# EAGLE design ernest (EAGLE 6.6.0)
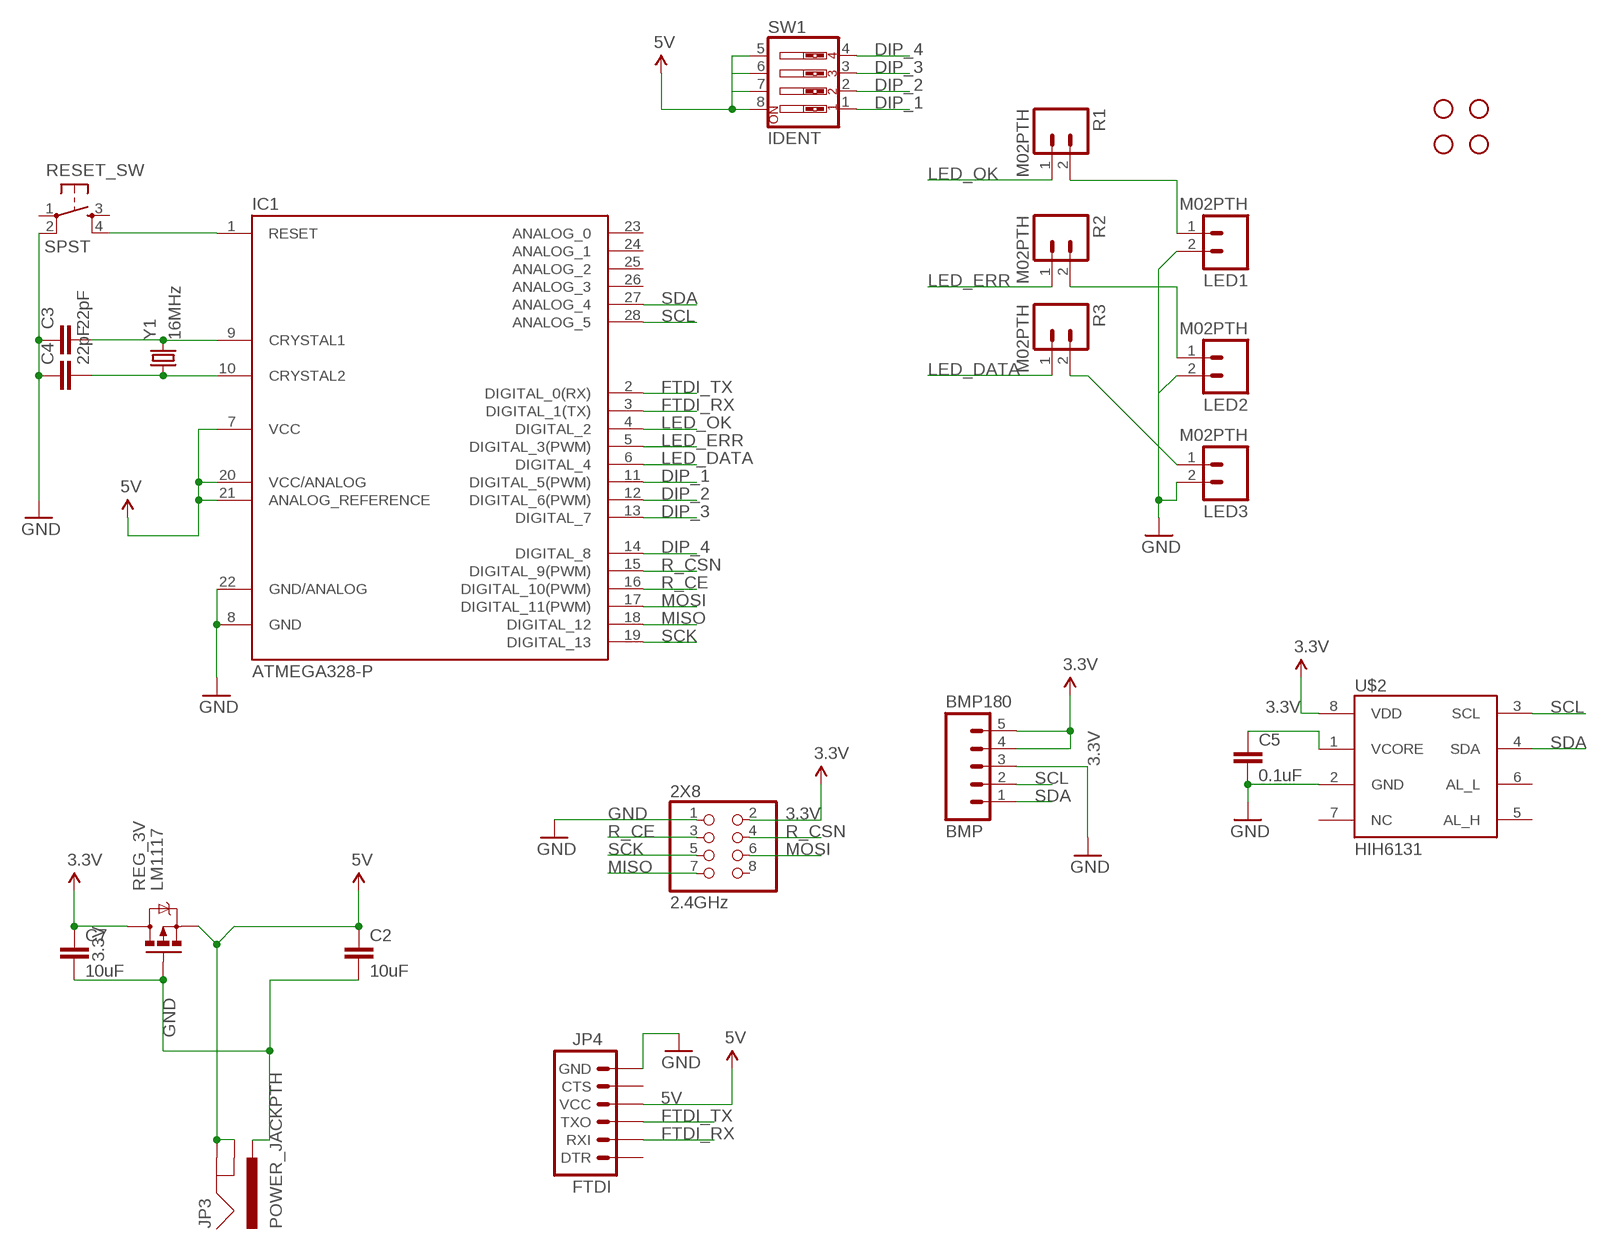
[diagram p0: schematic, sheet 1]

## Parts
2X8  2.4GHz  PINHD-2X4  [2X04]
BMP180  BMP  M05PTH  [1X05]
C2  10uF  CAPPTH  [CAP-PTH-SMALL]
C3  22pF  CAPPTH  [CAP-PTH-SMALL]
C4  22pF  CAPPTH  [CAP-PTH-SMALL]
C5  0.1uF  CAPPTH  [CAP-PTH-SMALL]
C7  10uF  CAPPTH  [CAP-PTH-SMALL]
IC1  ATMEGA328-P  ATMEGA168-PU  [DIL28-3]
JP3  POWER_JACKPTH  [POWER_JACK_PTH]
JP4  FTDI  ARDUINO_SERIAL_PROGRAMPTH  [1X06]
LED1  M02PTH  [1X02]
LED2  M02PTH  [1X02]
LED3  M02PTH  [1X02]
R1  M02PTH  [1X02]
R2  M02PTH  [1X02]
R3  M02PTH  [1X02]
REG_3V  LM1117  MOSFET-PCHANNELFQP27P06  [TO220V]
RESET_SW  SPST  TACTILE-SWITCH-PTH  [TAC-SWITCH-PTH]
STANDOFF1  STAND-OFF  [STAND-OFF]
STANDOFF2  STAND-OFF  [STAND-OFF]
STANDOFF3  STAND-OFF  [STAND-OFF]
STANDOFF4  STAND-OFF  [STAND-OFF]
SW1  IDENT  SW_DIP-4  [EDG-04]
U$2  HIH6131  [SOIC8]
Y1  16MHz  CRYSTALHC49US  [HC49US]

## Nets
3.3V: 2X8.2 BMP180.4 BMP180.5 C7.1 REG_3V.2(D) U$2.8(VDD)
5V: C2.1 IC1.7(VCC) IC1.20(VCC/ANALOG) IC1.21(ANALOG_REFERENCE) JP3.GND JP3.GNDBREAK JP4.4(VCC) REG_3V.3(S) SW1.5 SW1.6 SW1.7 SW1.8
DIP_1: IC1.11(DIGITAL_5(PWM)) SW1.1
DIP_2: IC1.12(DIGITAL_6(PWM)) SW1.2
DIP_3: IC1.13(DIGITAL_7) SW1.3
DIP_4: IC1.14(DIGITAL_8) SW1.4
FTDI_RX: IC1.3(DIGITAL_1(TX)) JP4.2(RXI)
FTDI_TX: IC1.2(DIGITAL_0(RX)) JP4.3(TXO)
GND: 2X8.1 BMP180.3 C2.2 C3.1 C4.1 C5.2 C7.2 IC1.8(GND) IC1.22(GND/ANALOG) JP3.PWR JP4.6(GND) LED1.2 LED2.2 LED3.2 REG_3V.1(G) RESET_SW.2 U$2.2(GND)
LED_DATA: IC1.6(DIGITAL_4) R3.1
LED_ERR: IC1.5(DIGITAL_3(PWM)) R2.1
LED_OK: IC1.4(DIGITAL_2) R1.1
MISO: 2X8.7 IC1.18(DIGITAL_12)
MOSI: 2X8.6 IC1.17(DIGITAL_11(PWM))
N$4: LED1.1 R1.2
N$5: LED2.1 R2.2
N$6: LED3.1 R3.2
N$12: IC1.1(RESET) RESET_SW.4
N$17: C5.1 U$2.1(VCORE)
N$20: C3.2 IC1.9(CRYSTAL1) Y1.2
N$21: C4.2 IC1.10(CRYSTAL2) Y1.1
R_CE: 2X8.3 IC1.16(DIGITAL_10(PWM))
R_CSN: 2X8.4 IC1.15(DIGITAL_9(PWM))
SCK: 2X8.5 IC1.19(DIGITAL_13)
SCL: BMP180.2 IC1.28(ANALOG_5) U$2.3(SCL)
SDA: BMP180.1 IC1.27(ANALOG_4) U$2.4(SDA)
Unconnected: 2X8.8 IC1.23(ANALOG_0) IC1.24(ANALOG_1) IC1.25(ANALOG_2) IC1.26(ANALOG_3) JP4.1(DTR) JP4.5(CTS) RESET_SW.1 RESET_SW.3 U$2.5(AL_H) U$2.6(AL_L) U$2.7(NC)

## Library data of the parts
2X8 = adafruit:PINHD-2X4: PIN HEADER
BMP180 = SparkFun-Connectors:M05: Header 5 Standard 5-pin 0.1" header. Use with straight break away headers (SKU : PRT-00116), right angle break away headers (PRT-00553), swiss pins (PRT-00743), machine pins (PRT-00117), and female headers (PRT-00115). Molex polarized connector foot print use with SKU : PRT-08230 with associated crimp pins and housings.
C2-C5 C7 = SparkFun-Capacitors:CAP: Capacitor Standard 0603 ceramic capacitor, and 0.1" leaded capacitor.
IC1 = Arduino-AVR:ATMEGA168-PU
JP3 = SparkFun-Connectors:POWER_JACK: Power Jack This is the standard 5.5mm barrel jack for power. The PTH is the most common, proven, reliable, footprint. The Slot footprint only works if the mill layer is transmitted to the PCB fab house so be warned. Mating wall wart : TOL-00298 (and others); PROD_ID: CONN-08197
JP4 = SparkFun-Connectors:ARDUINO_SERIAL_PROGRAM: FTDI connector footprints
LED1-LED3 R1-R3 = SparkFun-Connectors:M02: Standard 2-pin 0.1" header. Use with - straight break away headers ( PRT-00116) - right angle break away headers (PRT-00553) - swiss pins (PRT-00743) - machine pins (PRT-00117) - female headers (PRT-00115) Molex polarized connector foot print use with: PRT-08233 with associated crimp pins and housings. 2.54_SCREWTERM for use with PRT-10571. 3.5mm Screw Terminal footprints for PRT-08084 5mm Screw Terminal footprints for use with PRT-08432
REG_3V = User-Submitted:MOSFET-PCHANNEL: Generic PMOSFET IRLML2244 - TRANS-11153 (SOT-23 -20V -4.3A) (1.Gate 2.Source 3.Drain) FQP27P06 - COM-10349 <http://www.sparkfun.com/products/10349> (TO-220 -60V -27A) (1.Gate 2.Source 3.Drain)
RESET_SW = GeekAmmo:TACTILE-SWITCH: Tactile Switch 4 Pins, SPST NO
STANDOFF1-STANDOFF4 = SparkFun-Electromechanical:STAND-OFF: #4 Stand Off This is the mechanical footprint for a #4 phillips button head screw. Use the keepout ring to avoid running the screw head into surrounding components. SKU : PRT-00447
SW1 = special:SW_DIP-4: DIP SWITCH
U$2 = SparkFun-AnalogIC:HIH6131
Y1 = SparkFun-FreqCtrl:CRYSTAL: Various standard crystals. Proven footprints.

## Board
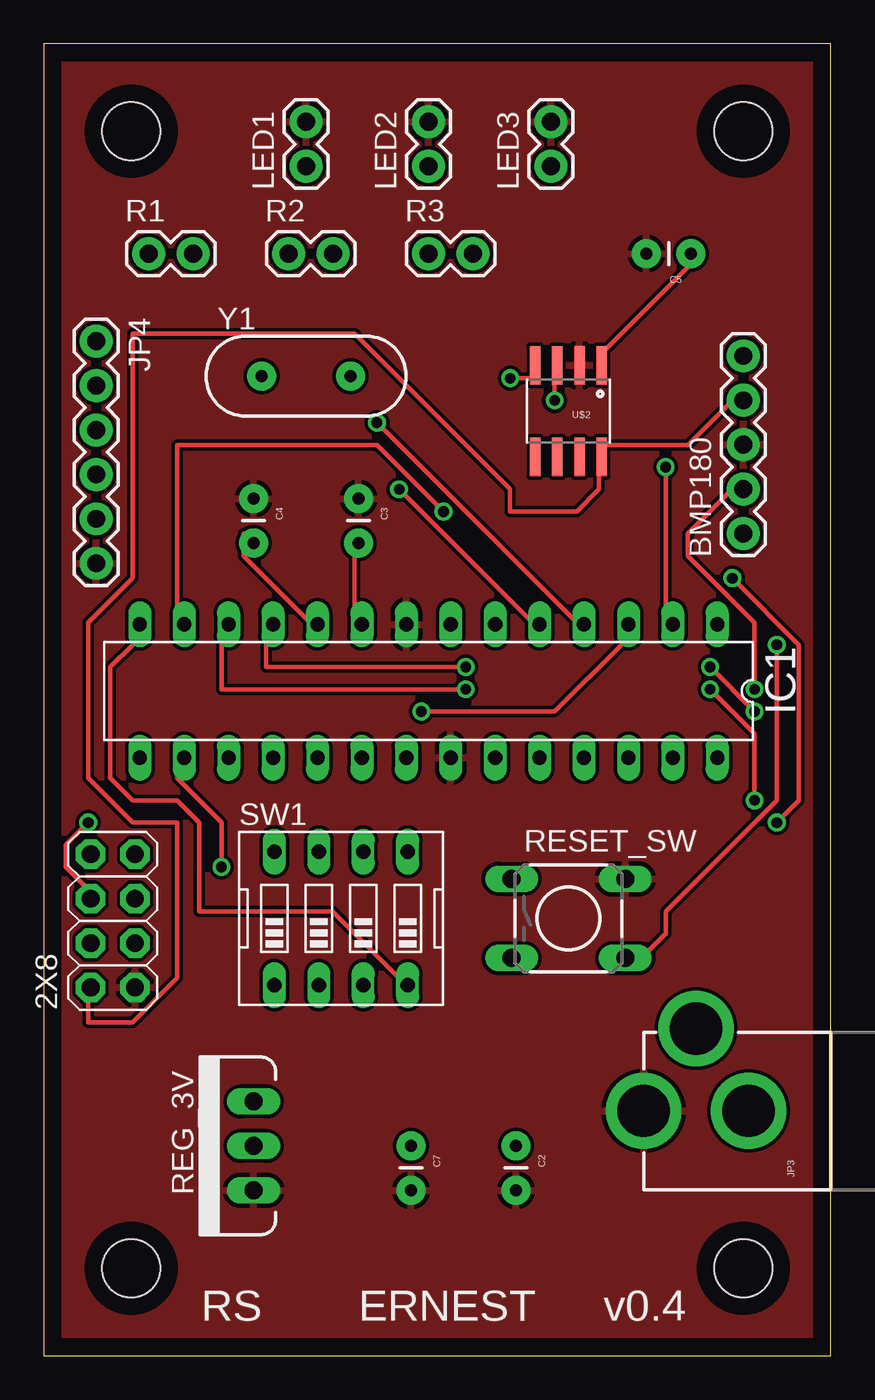
[diagram p1: board, top side]
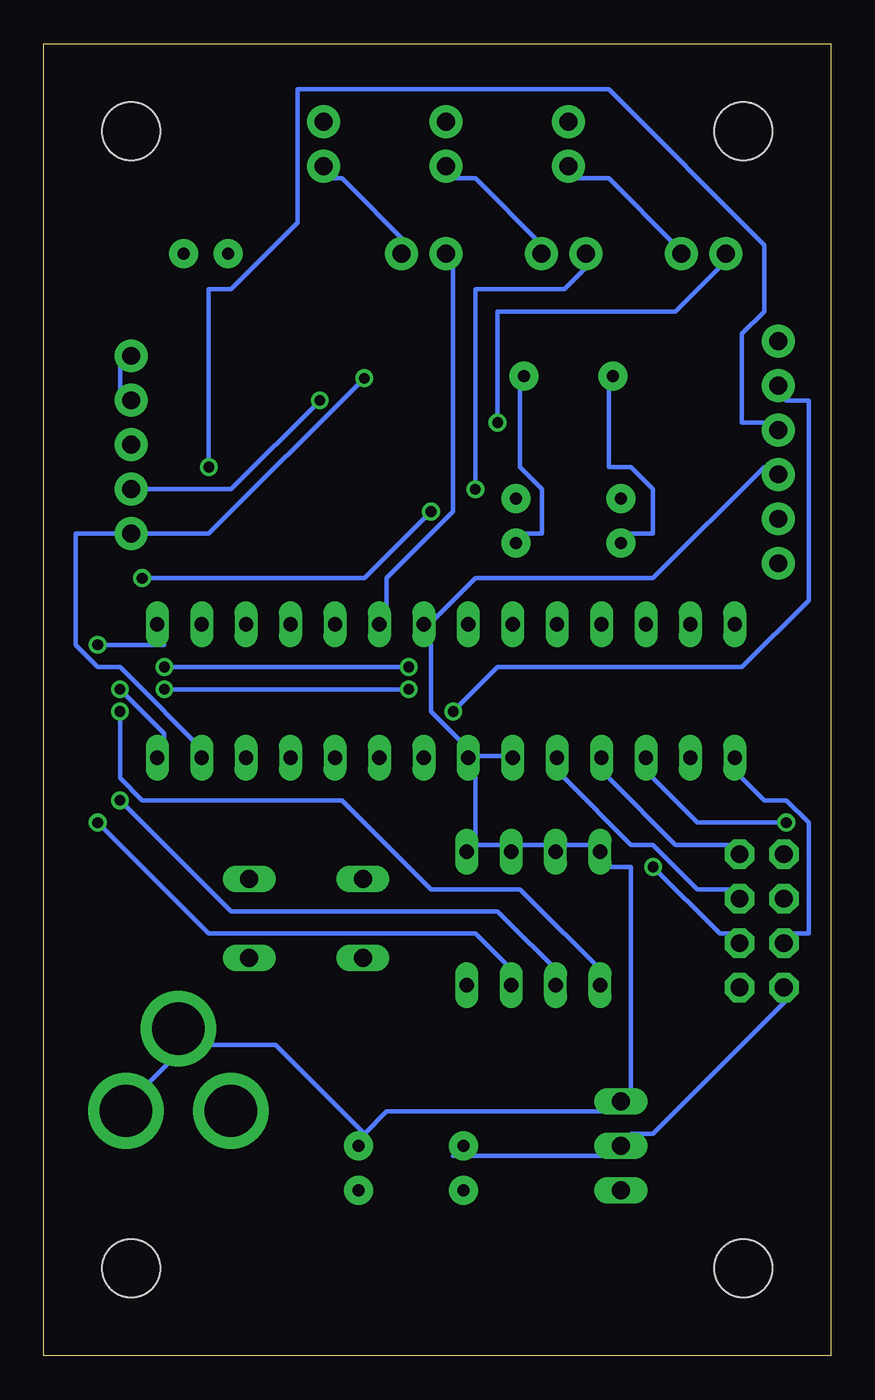
[diagram p2: board, bottom side, seen from below]

Size 45 x 75 mm. Coordinates in mm from the lower left corner, seen from the top.
Outline: 0,0 45,0 45,75 0,75 0,0
Copper layers (1*16): Top 0.035mm / dielectric 1.5mm / Bottom 0.035mm
Design rules "default": minimum track width 10mil, minimum drill 24mil, track to track 8mil, track to pad 8mil, pad to pad 8mil, via to via 8mil, smd to smd 8mil, copper to edge 40mil, drill to drill 8mil, minimum pad ring 10mil, minimum via ring 8mil, stop-mask expansion 4mil, vias tented up to drill 0mil, thermal gap 10mil

### Footprints (pad centres in the part's own frame; a part is rotated, then mirrored left to right if it is on the bottom)
2X04 = drill 1.016 pad 1.676 octagon: 1 -3.81,-1.27; 2 -3.81,1.27; 3 -1.27,-1.27; 4 -1.27,1.27; 5 1.27,-1.27; 6 1.27,1.27; 7 3.81,-1.27; 8 3.81,1.27
1X05 = drill 1.016 pad 1.88: 1 0,0; 2 2.54,0; 3 5.08,0; 4 7.62,0; 5 10.16,0
CAP-PTH-SMALL = drill 0.7 pad 1.651: 1 0,0; 2 2.54,0
DIL28-3 = drill 0.813 long: 1 -16.51,-3.81; 2 -13.97,-3.81; 3 -11.43,-3.81; 4 -8.89,-3.81; 5 -6.35,-3.81; 6 -3.81,-3.81; 7 -1.27,-3.81; 8 1.27,-3.81; 9 3.81,-3.81; 10 6.35,-3.81; 11 8.89,-3.81; 12 11.43,-3.81; 13 13.97,-3.81; 14 16.51,-3.81; 15 16.51,3.81; 16 13.97,3.81; 17 11.43,3.81; 18 8.89,3.81; 19 6.35,3.81; 20 3.81,3.81; 21 1.27,3.81; 22 -1.27,3.81; 23 -3.81,3.81; 24 -6.35,3.81; 25 -8.89,3.81; 26 -11.43,3.81; 27 -13.97,3.81; 28 -16.51,3.81
POWER_JACK_PTH = drill 2.997 pad 4.318: GND 0,7.7; GNDBREAK 4.7,10.7; PWR 0,13.7
1X06 = drill 1.016 pad 1.88: 1 0,0; 2 2.54,0; 3 5.08,0; 4 7.62,0; 5 10.16,0; 6 12.7,0
1X02 = drill 1.016 pad 1.88: 1 0,0; 2 2.54,0
TO220V = drill 1.016 long: 1 -2.54,0; 2 0,0; 3 2.54,0
TAC-SWITCH-PTH = drill 1.016 pad 1.524 long: 1 -3.251,2.261; 2 3.251,2.261; 3 -3.251,-2.261; 4 3.251,-2.261
STAND-OFF = hole 3.302: 0,0
EDG-04 = drill 0.813 long: 1 -3.81,-3.81; 2 -1.27,-3.81; 3 1.27,-3.81; 4 3.81,-3.81; 5 3.81,3.81; 6 1.27,3.81; 7 -1.27,3.81; 8 -3.81,3.81
SOIC8 = smd 0.61 x 2.21: 1 -1.905,-2.616; 2 -0.635,-2.616; 3 0.635,-2.616; 4 1.905,-2.616; 5 1.905,2.616; 6 0.635,2.616; 7 -0.635,2.616; 8 -1.905,2.616
HC49US = drill 0.7 pad 1.651: 1 -2.54,0; 2 2.54,0

### Placement (x,y rotation side)
2X8  3.95,24.86 90 top
BMP180  40,47 90 top
C2  27,12 270 top
C3  18,49 270 top
C4  12,49 270 top
C5  37,63 180 top
C7  21,12 270 top
IC1  22,38 180 top
JP3  48,14 90 top
JP4  3,58 270 top
LED1  15,68 90 top
LED2  22,68 90 top
LED3  29,68 90 top
R1  6,63 0 top
R2  14,63 0 top
R3  22,63 0 top
REG_3V  12,12 90 top
RESET_SW  30,25 0 top
STANDOFF1  40,70 90 top
STANDOFF2  5,70 0 top
STANDOFF3  40,5 0 top
STANDOFF4  5,5 0 top
SW1  17,25 0 top
U$2  30,54 180 top
Y1  15,56 0 top

### Tracks (layer width: path | path; a pad name or v marks a point on that pad's centre or on a via)
3.3V
  Top 0.254: BMP180.4 39.37,54.61 36.83,52.07 31.75,52.07 U$2.8 31.75,50.8 31.75,49.53 30.48,48.26 26.67,48.26 26.67,49.53 17.78,58.42 5.08,58.42 5.08,44.45 2.54,41.91 2.54,33.02 5.08,30.48 7.62,30.48 7.62,21.59 5.08,19.05 2.54,19.05 2.54,20.32 2X8.2
  Bottom 0.254: BMP180.5 40.64,57.15 40.64,54.61 BMP180.4 | C7.1 21.59,11.43 12.7,11.43 REG_3V.2 11.43,12.7 10.16,12.7 2.54,20.32 2X8.2
5V
  Bottom 0.254: 26.67,12.7 31.75,17.78 36.83,17.78 | 36.83,17.78 39.37,15.24 JP3.GND | 36.83,17.78 JP3.GNDBREAK | 15.24,29.21 12.7,29.21 SW1.8 12.7,27.94 11.43,27.94 11.43,15.24 REG_3V.3 12.7,13.97 25.4,13.97 26.67,12.7 | 15.24,29.21 17.78,29.21 | 15.24,29.21 SW1.7 | 17.78,29.21 20.32,29.21 | 17.78,29.21 SW1.6 | 20.32,34.29 17.78,34.29 IC1.20 | 20.32,34.29 22.86,36.83 22.86,40.64 IC1.7 22.86,41.91 20.32,44.45 10.16,44.45 3.81,50.8 JP4.4 | 20.32,34.29 IC1.21 20.32,33.02 20.32,29.21 | 20.32,29.21 SW1.5 | 26.67,12.7 C2.1
DIP_1  (via drill 0.61)
  Top 0.254: v38.1,39.37 v40.64,36.83 | v24.13,39.37 12.7,39.37 12.7,40.64 IC1.11
  Bottom 0.254: v40.64,36.83 40.64,33.02 39.37,31.75 27.94,31.75 22.86,26.67 17.78,26.67 12.7,21.59 SW1.1 | v24.13,39.37 v38.1,39.37
DIP_2  (via drill 0.61)
  Top 0.254: v40.64,31.75 40.64,35.56 v38.1,38.1 | v24.13,38.1 10.16,38.1 10.16,40.64 IC1.12
  Bottom 0.254: v40.64,31.75 34.29,25.4 19.05,25.4 15.24,21.59 SW1.2 | v24.13,38.1 v38.1,38.1
DIP_3  (via drill 0.61)
  Top 0.254: v41.91,30.48 43.18,31.75 43.18,40.64 v39.37,44.45 | v22.86,48.26 19.05,52.07 7.62,52.07 7.62,41.91 IC1.13
  Bottom 0.254: v41.91,30.48 35.56,24.13 20.32,24.13 17.78,21.59 SW1.3 | v39.37,44.45 26.67,44.45 v22.86,48.26
DIP_4
  Top 0.254: SW1.4 20.32,21.59 16.51,25.4 8.89,25.4 8.89,30.48 7.62,31.75 5.08,31.75 3.81,33.02 3.81,39.37 5.08,40.64 IC1.14
FTDI_RX  (via drill 0.61)
  Top 0.254: v21.59,36.83 29.21,36.83 33.02,40.64 IC1.3
  Bottom 0.254: v21.59,36.83 19.05,39.37 5.08,39.37 1.27,43.18 1.27,54.61 2.54,54.61 JP4.2
FTDI_TX  (via drill 0.61)
  Top 0.254: v35.56,50.8 35.56,41.91 IC1.2
  Bottom 0.254: v35.56,50.8 35.56,60.96 34.29,60.96 30.48,64.77 30.48,72.39 12.7,72.39 3.81,63.5 3.81,59.69 5.08,58.42 5.08,53.34 3.81,53.34 JP4.3
GND
  pour Top: 0,0 45,0 45,75 0,75
LED_DATA
  Bottom 0.254: IC1.6 25.4,41.91 25.4,44.45 21.59,48.26 21.59,62.23 R3.1
LED_ERR  (via drill 0.61)
  Top 0.254: v20.32,49.53 27.94,41.91 IC1.5
  Bottom 0.254: v20.32,49.53 20.32,60.96 15.24,60.96 13.97,62.23 R2.1
LED_OK  (via drill 0.61)
  Top 0.254: v19.05,53.34 30.48,41.91 IC1.4
  Bottom 0.254: v19.05,53.34 19.05,59.69 8.89,59.69 6.35,62.23 R1.1
MISO
  Bottom 0.254: IC1.18 12.7,33.02 8.89,29.21 5.08,29.21 2X8.7
MOSI  (via drill 0.61)
  Top 0.254: v2.54,30.48 1.27,29.21 1.27,27.94 2.54,26.67 2X8.6
  Bottom 0.254: v2.54,30.48 7.62,30.48 10.16,33.02 IC1.17
N$4
  Bottom 0.254: R1.2 8.89,63.5 12.7,67.31 15.24,67.31 LED1.1
N$5
  Bottom 0.254: R2.2 16.51,63.5 20.32,67.31 21.59,67.31 LED2.1
N$6
  Bottom 0.254: R3.2 24.13,63.5 27.94,67.31 29.21,67.31 LED3.1
N$12  (via drill 0.61)
  Top 0.254: v41.91,40.64 41.91,31.75 35.56,25.4 35.56,24.13 34.29,22.86 RESET_SW.4
  Bottom 0.254: v41.91,40.64 38.1,40.64 IC1.1
N$17
  Top 0.254: U$2.1 31.75,57.15 36.83,62.23 C5.1
N$20
  Top 0.254: IC1.9 17.78,41.91 17.78,45.72 C3.2
  Bottom 0.254: Y1.2 17.78,55.88 17.78,50.8 16.51,49.53 16.51,46.99 17.78,46.99 C3.2
N$21
  Top 0.254: IC1.10 15.24,41.91 11.43,45.72 11.43,46.99 C4.2
  Bottom 0.254: Y1.1 12.7,55.88 12.7,50.8 11.43,50.8 10.16,49.53 10.16,46.99 11.43,46.99 C4.2
R_CE  (via drill 0.61)
  Top 0.254: v10.16,27.94 10.16,30.48 7.62,33.02 IC1.16
  Bottom 0.254: v10.16,27.94 6.35,24.13 5.08,24.13 2X8.3
R_CSN
  Bottom 0.254: IC1.15 5.08,33.02 3.81,31.75 2.54,31.75 1.27,30.48 1.27,24.13 2.54,24.13 2X8.4
SCK
  Bottom 0.254: IC1.19 15.24,33.02 11.43,29.21 10.16,29.21 7.62,26.67 5.08,26.67 2X8.5
SCL  (via drill 0.61)
  Top 0.254: v29.21,54.61 29.21,55.88 U$2.3 | v40.64,38.1 40.64,41.91 36.83,45.72 36.83,46.99 39.37,49.53 BMP180.2
  Bottom 0.254: v29.21,54.61 34.29,49.53 39.37,49.53 BMP180.2 | v40.64,38.1 38.1,35.56 38.1,34.29 IC1.28
SDA  (via drill 0.61)
  Top 0.254: v26.67,55.88 27.94,55.88 U$2.4
  Bottom 0.254: v26.67,55.88 35.56,46.99 39.37,46.99 BMP180.1 40.64,46.99 43.18,46.99 43.18,40.64 41.91,39.37 40.64,39.37 35.56,34.29 IC1.27

### Text on the board
_tsilk: RS | ERNEST | v0.4